# Altium schematic sheet L298N.culcut.SchDoc
size A3; SheetNumber: 2; SheetTotal: 2
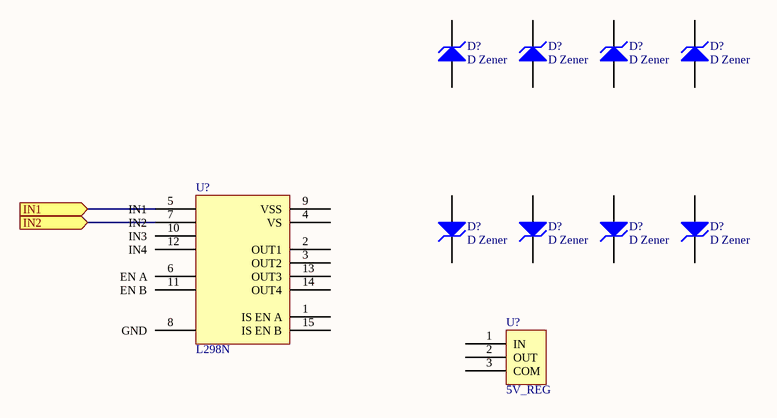
[diagram p0: L298N.culcut.SchDoc]

## Parts
(Parts that share a designator on the sheet are numbered #1, #2 ... from top to bottom, then left to right.)
D?#1  D Zener  [CAPC6846X22N]
D?#2  D Zener  [CAPC6846X22N]
D?#3  D Zener  [CAPC6846X22N]
D?#4  D Zener  [CAPC6846X22N]
D?#5  D Zener  [CAPC6846X22N]
D?#6  D Zener  [CAPC6846X22N]
D?#7  D Zener  [CAPC6846X22N]
D?#8  D Zener  [CAPC6846X22N]
U?#1  L298N  [L298N]
U?#2  5V_REG  [HSOP3-P-2.3]

## Ports
IN1 (in), IN2 (in)

## Nets

Not connected (* = marked no-connect by the designer): D?#1 1(A) 2(K); D?#2 1(A) 2(K); D?#3 1(A) 2(K); D?#4 1(A) 2(K); D?#5 1(A) 2(K); D?#6 1(A) 2(K); D?#7 1(A) 2(K); D?#8 1(A) 2(K); U?#1 1(IS_EN_A) 2(OUT1) 3(OUT2) 4(VS) 5(IN1) 6(EN_A) 7(IN2) 8(GND) 9(VSS) 10(IN3) 11(EN_B) 12(IN4) 13(OUT3) 14(OUT4) 15 (IS_EN_B); U?#2 1(IN) 2(OUT) 3(COM)

## Library data of the parts
D?#1-D?#8 = D Zener: Zener Diode; Published: 8-Jun-2000; LatestRevisionDate: 17-Jul-2002; LatestRevisionNote: Re-released for DXP Platform.; PackageReference: DIODE-0.7; Publisher: Altium Limited; PackageDescription: Diode, Thru-Hole; 2 Leads; 0.7 in Pin Spacing
U?#2 = TA78M05F_regulator